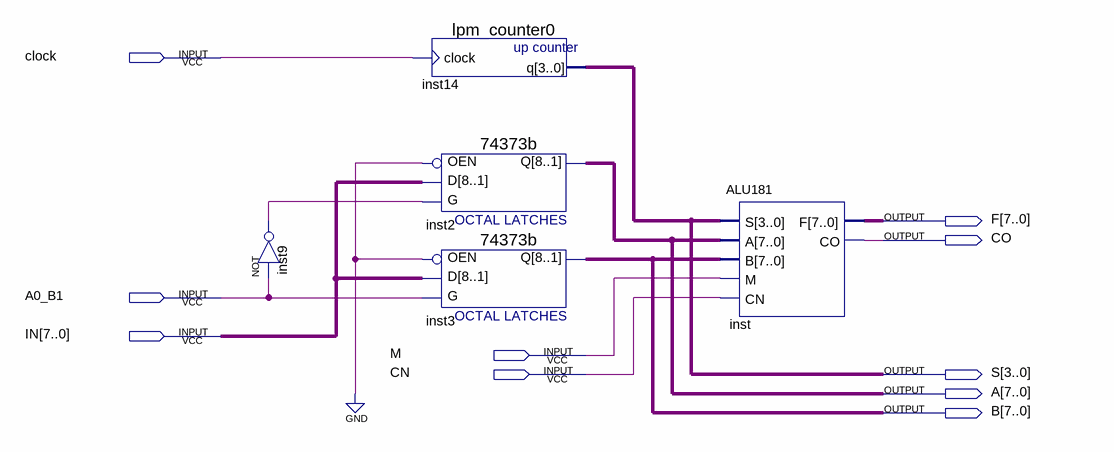
[diagram p0: schematic sheet]
// Quartus schematic Chapter2.bdf as structural Verilog: 5 symbols, 10 pins
module Chapter2 (
  input  clock,
  input  A0_B1,
  input  [7:0] IN,
  input  M,
  input  CN,
  output [7:0] F,
  output CO,
  output [3:0] S,
  output [7:0] A,
  output [7:0] B
);

  wire inst9_out;

  not inst9 (inst9_out, A0_B1);
  lpm_counter0 inst14 (.clock(clock), .q(S));
  \74373b  inst2 (.D(IN), .G(inst9_out), .OEN(1'b0), .Q(A));
  \74373b  inst3 (.D(IN), .G(A0_B1), .OEN(1'b0), .Q(B));
  ALU181 inst (.S(S), .A(A), .B(B), .M(M), .CN(CN), .F(F), .CO(CO));
endmodule
